# Altium schematic sheet 11_Revision.SchDoc: Power and Incoming USB
size 558 x 431 mm; Organization: Greenfield Tech Solutions; Address1: Molendreef 33; Address2: Ossendrecht; Address3: 4641CS; Address4: The Netherlands; SheetNumber: 11; SheetTotal: 11
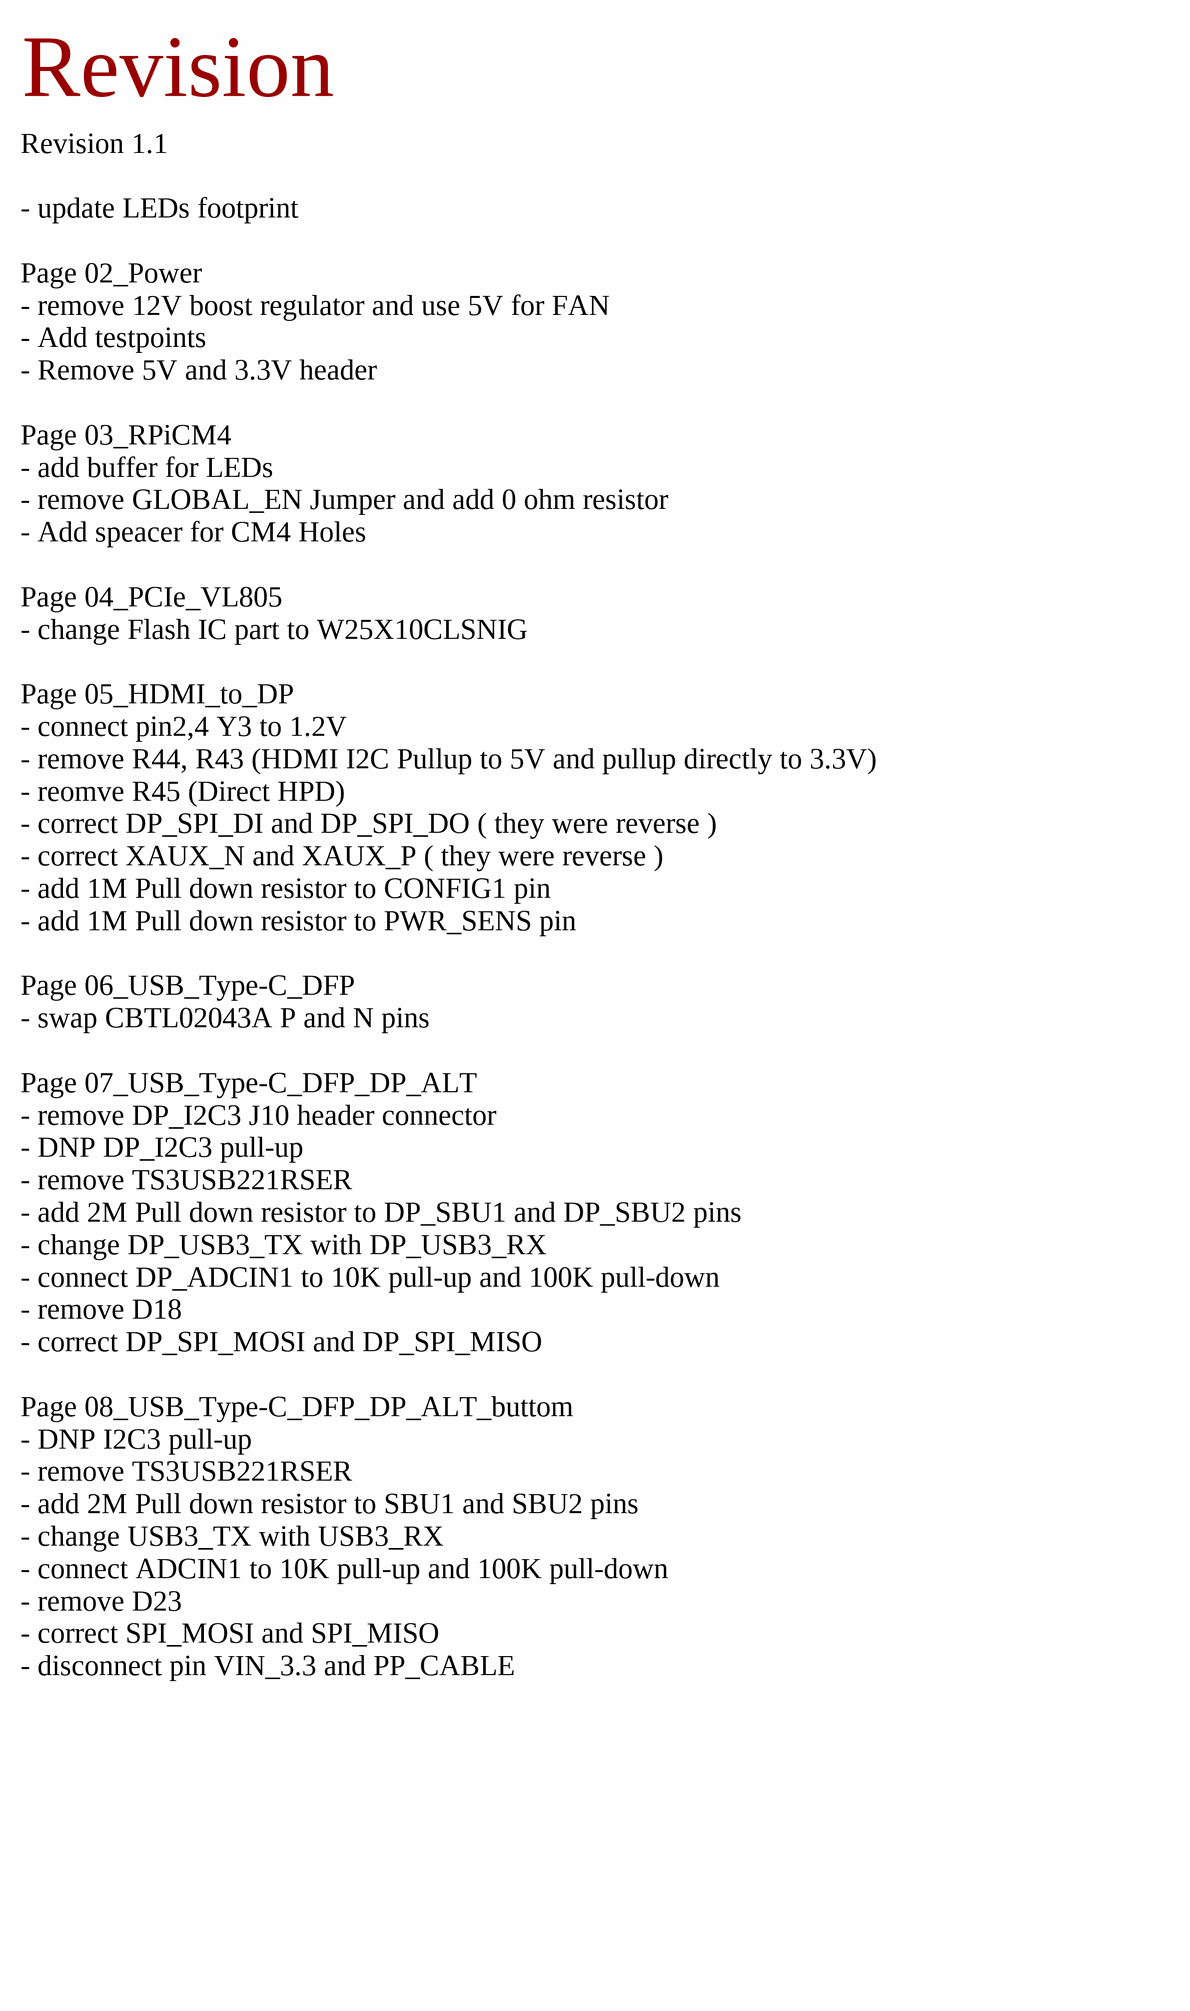
[diagram p0: 11_Revision.SchDoc]

## Notes on the sheet
- Revision
- Revision 1.1
  - update LEDs footprint
  Page 02_Power
  - remove 12V boost regulator and use 5V for FAN
  - Add testpoints
  - Remove 5V and 3.3V header
  Page 03_RPiCM4
  - add buffer for LEDs
  - remove GLOBAL_EN Jumper and add 0 ohm resistor
  - Add speacer for CM4 Holes
  Page 04_PCIe_VL805
  - change Flash IC part to W25X10CLSNIG
  Page 05_HDMI_to_DP
  - connect pin2,4 Y3 to 1.2V
  - remove R44, R43 (HDMI I2C Pullup to 5V and pullup directly to 3.3V)
  - reomve R45 (Direct HPD)
  - correct DP_SPI_DI and DP_SPI_DO ( they were reverse )
  - correct XAUX_N and XAUX_P ( they were reverse )
  - add 1M Pull down resistor to CONFIG1 pin
  - add 1M Pull down resistor to PWR_SENS pin
  Page 06_USB_Type-C_DFP
  - swap CBTL02043A P and N pins
  Page 07_USB_Type-C_DFP_DP_ALT
  - remove DP_I2C3 J10 header connector
  - DNP DP_I2C3 pull-up
  - remove TS3USB221RSER
  - add 2M Pull down resistor to DP_SBU1 and DP_SBU2 pins
  - change DP_USB3_TX with DP_USB3_RX
  - connect DP_ADCIN1 to 10K pull-up and 100K pull-down
  - remove D18
  - correct DP_SPI_MOSI and DP_SPI_MISO
  Page 08_USB_Type-C_DFP_DP_ALT_buttom
  - DNP I2C3 pull-up
  - remove TS3USB221RSER
  - add 2M Pull down resistor to SBU1 and SBU2 pins
  - change USB3_TX with USB3_RX
  - connect ADCIN1 to 10K pull-up and 100K pull-down
  - remove D23
  - correct SPI_MOSI and SPI_MISO
  - disconnect pin VIN_3.3 and PP_CABLE
- DWG. NO.
- REV.
- SHT.
- REVISION
- DESCRIPTION
- DATE
- APPROVED
- THIS DOCUMENT AND THE DATA DISCLOSED HEREIN OR HEREWITH IS THE PROPERTY OF ALTIUM LIMITED AND MAY BE FREELY DISTRIBUTED IN WHOLE. NO RIGHTS ARE RESERVED OR EXPRESS OR IMPLIED WARANTEE GIVEN.
- ENG:
- DSN:
- APPROVALS
- PROJECT
- DOCUMENT REVISION:
- DESIGN ITEM:
- CHK:
- BOM:
- REFERENCE DOCUMENTS
- PROJECT REVISION:
- TITLE
- FAB DWG:
- PCB DWG:
- ASSY DWG:
- SCALE:
- SIZE
- C
- CAGE CODE
- FILE NAME
- DWG NO.
- SHEET
- OF
- REV